# EAGLE design first design (EAGLE 9.3.0)
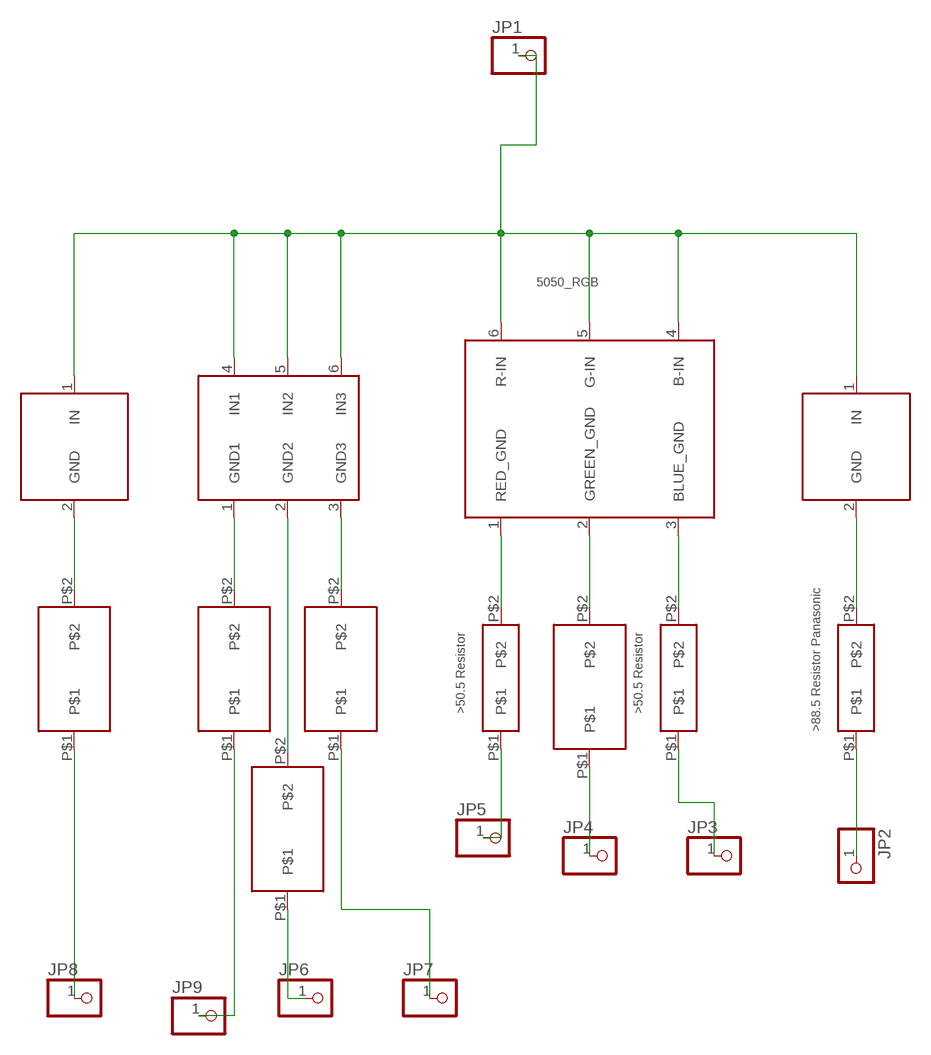
[diagram p0: schematic, sheet 1]

## Parts
JP1  PINHD-1X1  [1X01]
JP2  PINHD-1X1  [1X01]
JP3  PINHD-1X1  [1X01]
JP4  PINHD-1X1  [1X01]
JP5  PINHD-1X1  [1X01]
JP6  PINHD-1X1  [1X01]
JP7  PINHD-1X1  [1X01]
JP8  PINHD-1X1  [1X01]
JP9  PINHD-1X1  [1X01]
U$1  5.0X5.0_WHITE_LED  [COOLWHITE5050LED]
U$2  5050_RGB_LED  [RGB5050LED]
U$3  IR_LED  [IR_LED]
U$4  UV_LED  [UV_LED]
U$5  88.5_RESISTOR_PANASONIC  [88.7_RESISTOR_PANASONIC]
U$6  68_60_56_RESISTOR_VISHAY  [68_60_56_RESISTOR_VISHAY]
U$7  68_60_56_RESISTOR_VISHAY  [68_60_56_RESISTOR_VISHAY]
U$8  68_60_56_RESISTOR_VISHAY  [68_60_56_RESISTOR_VISHAY]
U$9  68_60_56_RESISTOR_VISHAY  [68_60_56_RESISTOR_VISHAY]
U$10  50.5_RESISTOR_TT  [50.5_RESISTOR_TT]
U$11  50.5_RESISTOR_TT  [50.5_RESISTOR_TT]
U$12  68_60_56_RESISTOR_VISHAY  [68_60_56_RESISTOR_VISHAY]

## Nets
N$1: U$1.3(GND3) U$9.P$2
N$2: U$1.2(GND2) U$8.P$2
N$3: U$1.1(GND1) U$7.P$2
N$4: U$3.2(GND) U$6.P$2
N$5: U$2.1(RED_GND) U$10.P$2
N$6: U$2.2(GREEN_GND) U$12.P$2
N$7: U$2.3(BLUE_GND) U$11.P$2
N$8: U$4.2(GND) U$5.P$2
N$9: JP8.1 U$6.P$1
N$10: JP9.1 U$7.P$1
N$11: JP6.1 U$8.P$1
N$12: JP1.1 U$1.4(IN1) U$1.5(IN2) U$1.6(IN3) U$2.4(B-IN) U$2.5(G-IN) U$2.6(R-IN) U$3.1(IN) U$4.1(IN)
N$13: JP7.1 U$9.P$1
N$14: JP5.1 U$10.P$1
N$15: JP4.1 U$12.P$1
N$16: JP3.1 U$11.P$1
N$17: JP2.1 U$5.P$1

## Library data of the parts
JP1-JP9 = pinhead:PINHD-1X1: PIN HEADER
U$1 = PCB_LED:5.0X5.0_WHITE_LED
U$2 = PCB_LED:5050_RGB_LED
U$3 = PCB_LED:IR_LED
U$4 = PCB_LED:UV_LED
U$5 = PCB_LED:88.5_RESISTOR_PANASONIC
U$6-U$9 U$12 = PCB_LED:68_60_56_RESISTOR_VISHAY
U$10 U$11 = PCB_LED:50.5_RESISTOR_TT

## Board
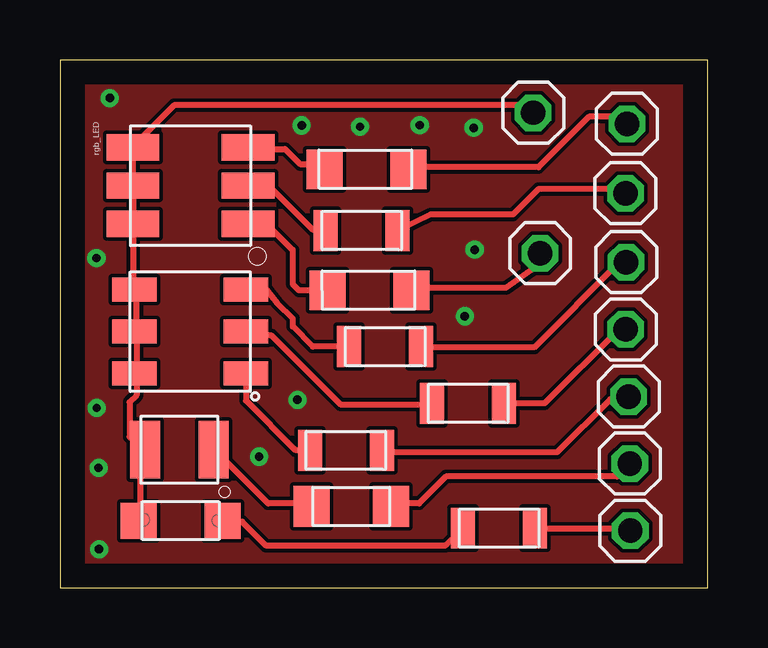
[diagram p1: board, top side]
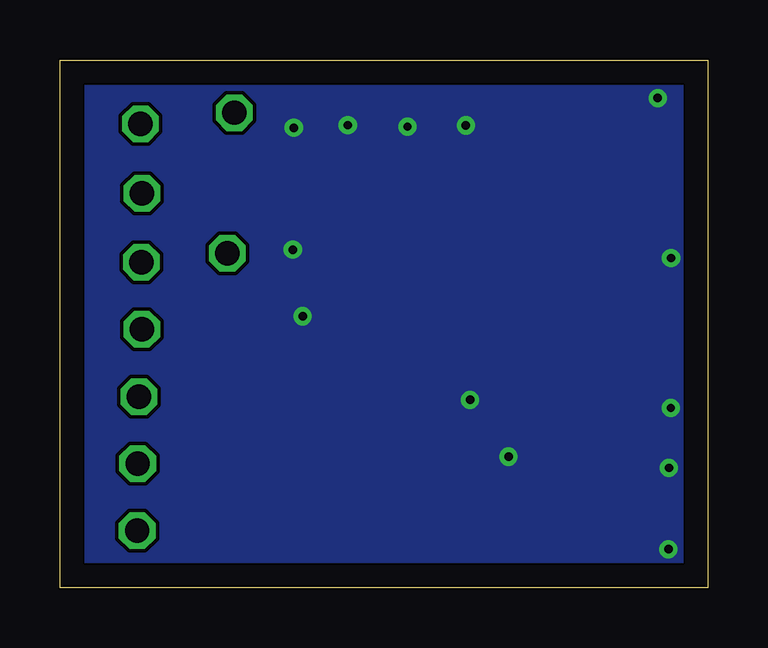
[diagram p2: board, bottom side, seen from below]

Size 27 x 22 mm. Coordinates in mm from the lower left corner, seen from the top.
Outline: 0,0 27,0 27,22 0,22 0,0
Copper layers (1*16): Top 0.035mm / dielectric 1.5mm / Bottom 0.035mm
Design rules "default": minimum track width 6mil, minimum drill 0.35mm, track to track 6mil, track to pad 6mil, pad to pad 6mil, via to via 6mil, smd to smd 6mil, copper to edge 40mil, drill to drill 6mil, minimum pad ring 10mil, minimum via ring 8mil, stop-mask expansion 4mil, vias tented up to drill 0mil, thermal gap 10mil

### Footprints (pad centres in the part's own frame; a part is rotated, then mirrored left to right if it is on the bottom)
1X01 = drill 1.016 octagon: 1 0,0
COOLWHITE5050LED = smd 1 x 1.85: 1 -1.75,-2.325; 2 0,-2.325; 3 1.75,-2.325; 4 -1.75,2.325; 5 0,2.325; 6 1.75,2.325
RGB5050LED = smd 1.1 x 2.2: 1 -1.6,-2.4; 2 0,-2.4; 3 1.6,-2.4; 4 1.6,2.4; 5 0,2.4; 6 -1.6,2.4
IR_LED = smd 1.5 x 1.5: 1 0,1.75; 2 0,-1.75
UV_LED = smd 2.4 x 1.25: 1 0,1.425; 2 0,-1.425
88.7_RESISTOR_PANASONIC = smd 1.5 x 1.7: P$1 -2.96,-0.01; P$2 0.35,0
68_60_56_RESISTOR_VISHAY = smd 1 x 1.7: P$1 -3,0; P$2 0,0
50.5_RESISTOR_TT = smd 1.5 x 1.65: P$1 -3.5,0; P$2 0,0

### Placement (x,y rotation side)
JP1  19.73,19.8 0 top
JP2  23.76,5.17 0 top
JP3  23.64,19.34 0 top
JP4  23.58,16.44 0 top
JP5  20.02,13.94 0 top
JP6  23.59,10.77 0 top
JP7  23.61,13.57 0 top
JP8  23.78,2.37 0 top
JP9  23.71,7.96 0 top
U$1  5.43,10.67 90 top
U$2  5.44,16.76 90 top
U$3  5.03,2.79 90 top
U$4  4.98,5.75 90 top
U$5  10.84,3.38 180 top
U$6  16.81,2.48 180 top
U$7  10.42,5.72 180 top
U$8  15.52,7.68 180 top
U$9  12.06,10.05 180 top
U$10  11.16,12.39 180 top
U$11  11.03,17.43 180 top
U$12  11.08,14.89 180 top

### Tracks (layer width: path | path; a pad name or v marks a point on that pad's centre or on a via)
GND  (via drill 0.35)
  other vias: 10.08,19.27 15,19.28 17.29,14.09 1.61,4.99 9.9,7.83 8.3,5.46 1.52,13.74 1.63,1.6 2.08,20.41 16.88,11.31 17.25,19.17 12.51,19.22 1.53,7.49
  pour Top: 0.12,21.92 27.05,21.92 27.09,21.88 27.09,0.16 26.97,0.04 0.16,0.04 0.04,0.16 0.04,21.9 0.06,21.92
  pour Bottom: 0.21,21.82 27.02,21.82 27.02,0.1 0.27,0.1 0.21,21.72 0.26,21.77 0.36,21.77
N$1
  Top 0.254: U$9.P$2 10.54,10.05 9.71,10.88 9.71,11.21 9.07,11.85 8.62,12.42 U$1.3
N$2
  Top 0.254: U$8.P$2 15.49,7.64 11.69,7.64 8.82,10.51 7.92,10.51 U$1.2
N$3
  Top 0.254: U$7.P$2 9.83,5.72 7.75,7.8 U$1.1
N$4
  Top 0.254: U$3.2 6.83,2.74 7.6,2.74 8.6,1.75 16.07,1.75 16.76,2.44 U$6.P$2
N$5
  Top 0.254: U$10.P$2 9.96,12.39 9.7,12.65 9.7,14.08 8.62,15.16 U$2.1
N$6
  Top 0.254: U$2.2 8.25,16.76 8.36,16.87 8.59,16.87 10.53,14.94 10.97,14.94 U$12.P$2
N$7
  Top 0.254: U$11.P$2 10.89,17.67 10,17.67 9.38,18.29 7.92,18.29 U$2.3
N$8
  Top 0.254: U$5.P$2 10.37,3.5 8.69,3.5 6.55,5.64 U$4.2
N$9
  Top 0.254: U$6.P$1 19.81,2.44 23.68,2.44 JP8.1
N$10
  Top 0.254: U$7.P$1 13.45,5.64 20.73,5.64 22.94,7.85 JP9.1
N$11
  Top 0.254: U$8.P$1 20.21,7.68 23.29,10.77 JP6.1
N$12
  Top 0.254: U$3.1 3.35,2.9 3.35,5.49 3.5,5.64 U$4.1 2.9,6.29 2.9,7.73 3.19,8.02 3.19,8.83 U$1.4 3.2,8.99 3.2,10.67 U$1.5 3.2,10.82 3.2,12.34 U$1.6 3.05,12.5 3.05,15.09 U$2.6 3.05,16.61 U$2.5 3.05,18.29 U$2.4 3.04,18.4 4.76,20.11 19.42,20.11 JP1.1
N$13
  Top 0.254: U$9.P$1 15.09,10.02 19.77,10.02 23.29,13.54 JP7.1
N$14
  Top 0.254: U$10.P$1 14.78,12.5 18.59,12.5 19.8,13.34 JP5.1
N$15
  Top 0.254: U$12.P$1 15.45,15.55 18.89,15.55 19.94,16.61 23.38,16.61 JP4.1
N$16
  Top 0.254: JP3.1 23.35,19.63 22.06,19.63 19.95,17.53 14.66,17.53 14.56,17.43 U$11.P$1
N$17
  Top 0.254: U$5.P$1 13.91,3.5 14.09,3.5 14.97,3.5 16.1,4.63 23.22,4.63 JP2.1